# EAGLE design Simple-Temperature-Controller (EAGLE 6.3)

## Sheet 1 of 6: Switching Power Supply
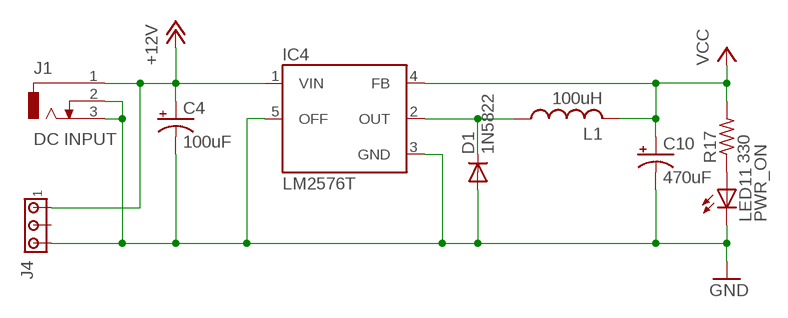
[diagram p0: schematic, sheet 1]

### Parts
C4  100uF  CPOL-USE2.5-6  [E2,5-6]
C10  470uF  CPOL-USE3.5-8  [E3,5-8]
D1  1N5822  1N5400  [DO201-15]
IC4  LM2576T  [TO220-5]
J1  DC INPUT  DCJ0202  [DCJ0202]
J4  MTA03-100  [10X03MTA]
L1  100uH  L-USTJ3-U2  [TJ3-U2]
LED11  PWR_ON  LED3MM  [LED3MM]
R17  330  R-US_0207/10  [0207/10]

### Nets
+12V [power]: C4.+ IC4.1(VIN) J1.1 J4.1 ; also sheet 6
GND [gnd]: C4.- C10.- D1.A IC4.3(GND) IC4.5(OFF) J1.2 J1.3 J4.3 LED11.K(C) ; also sheet 2,3,4,5,6
N$32: D1.C IC4.2(OUT) L1.1
N$33: LED11.A R17.1
VCC [vcc]: C10.+ IC4.4(FB) L1.2 R17.2 ; also sheet 2,4,5,6
Unconnected: J4.2

## Sheet 2 of 6: Minimum Sistem
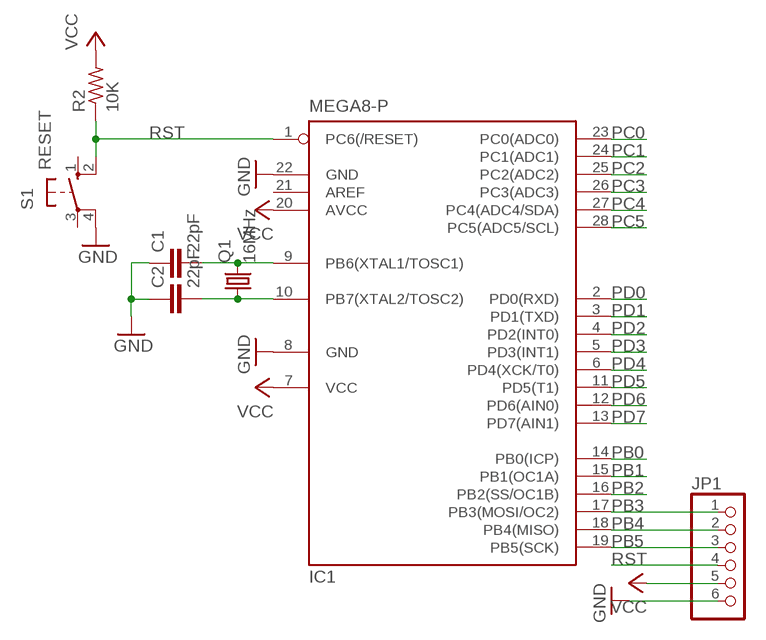
[diagram p1: schematic, sheet 2]

### Parts
C1  22pF  CAPACITOR025-024X044  [RESISTOR_C025-024X044]
C2  22pF  CAPACITOR025-024X044  [RESISTOR_C025-024X044]
IC1  MEGA8-P  [DIL28-3]
JP1  PINHD-1X6  [1X06]
Q1  16MHz  CRYSTALHC49S  [HC49/S]
R2  10K  RESISTOR0207/10  [RESISTOR_0207/10]
S1  RESET  PUSH-BUTTON  [B3F-10XX]

### Nets
GND [gnd]: C1.1 C2.1 IC1.8(GND) IC1.22(GND) JP1.6 S1.4(P1) ; also sheet 1,3,4,5,6
N$2: C1.2 IC1.9(PB6(XTAL1/TOSC1)) Q1.2
N$3: C2.2 IC1.10(PB7(XTAL2/TOSC2)) Q1.1
PB0: IC1.14(PB0(ICP)) ; also sheet 4
PB1: IC1.15(PB1(OC1A)) ; also sheet 4
PB2: IC1.16(PB2(SS/OC1B)) ; also sheet 4
PB3: IC1.17(PB3(MOSI/OC2)) JP1.1 ; also sheet 4
PB4: IC1.18(PB4(MISO)) JP1.2 ; also sheet 4
PB5: IC1.19(PB5(SCK)) JP1.3 ; also sheet 4
PC0: IC1.23(PC0(ADC0)) ; also sheet 3
PC1: IC1.24(PC1(ADC1)) ; also sheet 3
PC2: IC1.25(PC2(ADC2)) ; also sheet 3
PC3: IC1.26(PC3(ADC3)) ; also sheet 3
PC4: IC1.27(PC4(ADC4/SDA)) ; also sheet 5
PC5: IC1.28(PC5(ADC5/SCL)) ; also sheet 5
PD0: IC1.2(PD0(RXD)) ; also sheet 6
PD1: IC1.3(PD1(TXD)) ; also sheet 6
PD2: IC1.4(PD2(INT0)) ; also sheet 6
PD3: IC1.5(PD3(INT1)) ; also sheet 6
PD4: IC1.6(PD4(XCK/T0)) ; also sheet 6
PD5: IC1.11(PD5(T1))
PD6: IC1.12(PD6(AIN0))
PD7: IC1.13(PD7(AIN1))
RST: IC1.1(PC6(/RESET)) JP1.4 R2.1 S1.2(S1)
VCC [vcc]: IC1.7(VCC) IC1.20(AVCC) JP1.5 R2.2 ; also sheet 1,4,5,6
Unconnected: IC1.21(AREF) S1.1(S) S1.3(P)

## Sheet 3 of 6: Input Switch
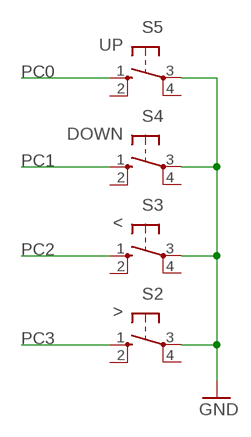
[diagram p2: schematic, sheet 3]

### Parts
S2  >  PUSH-BUTTON  [B3F-10XX]
S3  <  PUSH-BUTTON  [B3F-10XX]
S4  DOWN  PUSH-BUTTON  [B3F-10XX]
S5  UP  PUSH-BUTTON  [B3F-10XX]

### Nets
GND [gnd]: S2.3(P) S3.3(P) S4.3(P) S5.3(P) ; also sheet 1,2,4,5,6
PC0: S5.1(S) ; also sheet 2
PC1: S4.1(S) ; also sheet 2
PC2: S3.1(S) ; also sheet 2
PC3: S2.1(S) ; also sheet 2
Unconnected: S2.2(S1) S2.4(P1) S3.2(S1) S3.4(P1) S4.2(S1) S4.4(P1) S5.2(S1) S5.4(P1)

## Sheet 4 of 6: LCD 2X16
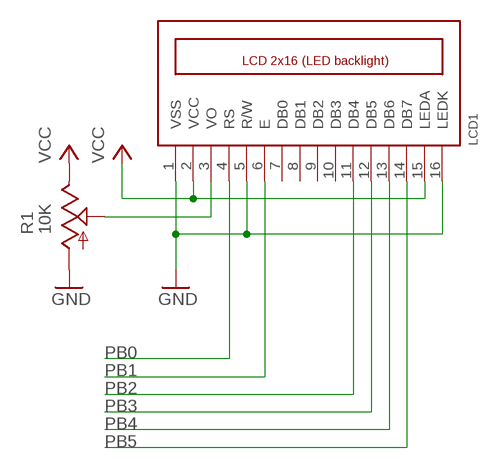
[diagram p3: schematic, sheet 4]

### Parts
LCD1  LCD-2X16  [LCD-2X16]
R1  10K  TRIMPOTCA6V  [POT_CA6V]

### Nets
GND [gnd]: LCD1.1(VSS) LCD1.5(R/W) LCD1.16(LEDK) R1.A ; also sheet 1,2,3,5,6
N$7: LCD1.3(VO) R1.S
PB0: LCD1.4(RS) ; also sheet 2
PB1: LCD1.6(E) ; also sheet 2
PB2: LCD1.11(DB4) ; also sheet 2
PB3: LCD1.12(DB5) ; also sheet 2
PB4: LCD1.13(DB6) ; also sheet 2
PB5: LCD1.14(DB7) ; also sheet 2
VCC [vcc]: LCD1.2(VCC) LCD1.15(LEDA) R1.E ; also sheet 1,2,5,6
Unconnected: LCD1.7(DB0) LCD1.8(DB1) LCD1.9(DB2) LCD1.10(DB3)

## Sheet 5 of 6: RTC
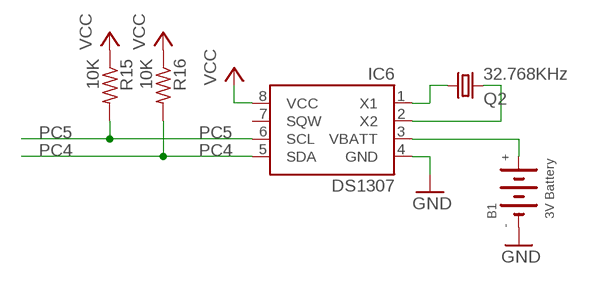
[diagram p4: schematic, sheet 5]

### Parts
B1  3V Battery  BATTERYCR2032  [CR2032]
IC6  DS1307  [DIP08]
Q2  32.768KHz  CRYSTALTC26H  [TC26H]
R15  10K  R-US_0207/10  [0207/10]
R16  10K  R-US_0207/10  [0207/10]

### Nets
GND [gnd]: B1.- IC6.4(GND) ; also sheet 1,2,3,4,6
N$29: IC6.1(X1) Q2.1
N$30: IC6.2(X2) Q2.2
N$31: B1.+ IC6.3(VBATT)
PC4: IC6.5(SDA) R16.2 ; also sheet 2
PC5: IC6.6(SCL) R15.2 ; also sheet 2
VCC [vcc]: IC6.8(VCC) R15.1 R16.1 ; also sheet 1,2,4,6
Unconnected: IC6.7(SQW)

## Sheet 6 of 6: Sensor & Relay Output
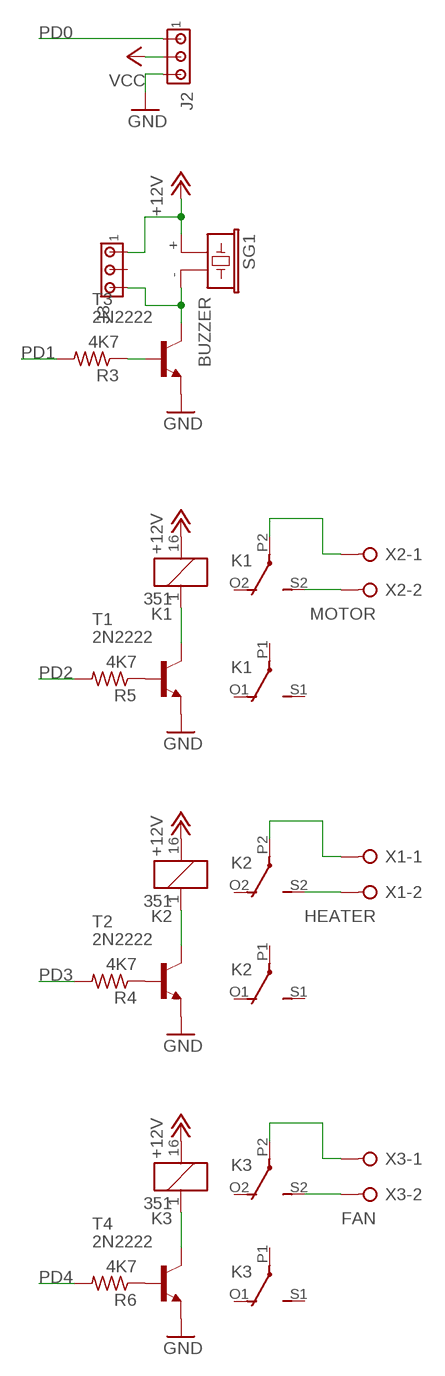
[diagram p5: schematic, sheet 6]

### Parts
J2  MTA03-100  [10X03MTA]
J3  MTA03-100  [10X03MTA]
K1  351  [351]
K2  351  [351]
K3  351  [351]
R3  4K7  R-US_0207/10  [0207/10]
R4  4K7  R-US_0207/10  [0207/10]
R5  4K7  R-US_0207/10  [0207/10]
R6  4K7  R-US_0207/10  [0207/10]
SG1  BUZZER  F/CM12P  [F/CM12P]
T1  2N2222  [TO92-EBC-OVAL]
T2  2N2222  [TO92-EBC-OVAL]
T3  2N2222  [TO92-EBC-OVAL]
T4  2N2222  [TO92-EBC-OVAL]
X1  HEATER  W237-02P  [W237-132]
X2  MOTOR  W237-02P  [W237-132]
X3  FAN  W237-02P  [W237-132]

### Nets
+12V [power]: J3.1 K1.16 K2.16 K3.16 SG1.+ ; also sheet 1
GND [gnd]: J2.3 T1.E T2.E T3.E T4.E ; also sheet 1,2,3,4,5
N$1: R5.1 T1.B
N$4: K1.1 T1.C
N$5: K2.1 T2.C
N$6: K1.P2(3:P) X2.1
N$8: K2.S2(3:S) X1.2
N$9: R4.1 T2.B
N$10: K3.1 T4.C
N$11: K3.S2(3:S) X3.2
N$12: R6.1 T4.B
N$13: K1.S2(3:S) X2.2
N$14: K2.P2(3:P) X1.1
N$15: K3.P2(3:P) X3.1
N$18: J3.3 SG1.- T3.C
N$19: R3.1 T3.B
PD0: J2.1 ; also sheet 2
PD1: R3.2 ; also sheet 2
PD2: R5.2 ; also sheet 2
PD3: R4.2 ; also sheet 2
PD4: R6.2 ; also sheet 2
VCC [vcc]: J2.2 ; also sheet 1,2,4,5
Unconnected: J3.2 K1.O1(2:O) K1.O2(3:O) K1.P1(2:P) K1.S1(2:S) K2.O1(2:O) K2.O2(3:O) K2.P1(2:P) K2.S1(2:S) K3.O1(2:O) K3.O2(3:O) K3.P1(2:P) K3.S1(2:S)

## Library data of the parts
B1 = microbuilder:BATTERY
C1 C2 = barelang-store:CAPACITOR: CAPACITOR, European symbol
C4 C10 = resistor:CPOL-US: POLARIZED CAPACITOR, American symbol
D1 = diode:1N5400: DIODE standard rectifier, 3 A, 50 V (Motorola)
IC1 = atmel:MEGA8-P: MICROCONTROLLER 8 Kbytes FLASH, 1 kbytes SRAM, 512 bytes EEPROM, USART, 4-channel 10 bit ADC, 2-channel 8 bit ADC Pin compatible with Atmega48, ATMega88, ATMega168 Source: avr.lbr; OC_FARNELL: unknown; OC_NEWARK: unknown
IC4 = v-reg-3:LM2576: National Semiconductor <http://www.national.com> 3.0A "Simple Switcher"(c) 52kHz, Vout 1.23-37V (HV: 57V), Vin 40V (HV: 60V), 50µA standby current
IC6 = SparkFun:DS1307
J1 = con-jack:DCJ0202: DC POWER JACK Source: DCJ0202.pdf; OC_FARNELL: unknown; OC_NEWARK: unknown
J2-J4 = con-amp:MTA03-100: AMP connector
JP1 = barelang-store:PINHD-1X6: PIN HEADER
K1-K3 = relay:351: RELAY 2 x switch, Omron; OC_FARNELL: unknown; OC_NEWARK: unknown
L1 = resistor:L-US: INDUCTOR, American symbol
LCD1 = barelang-store:LCD-2X16
LED11 = led:LED: LED OSRAM: - CHIPLED LG R971, LG N971, LY N971, LG Q971, LY Q971, LO R971, LY R971 LH N974, LH R974 LS Q976, LO Q976, LY Q976 LO Q996 - Hyper CHIPLED LW Q18S LB Q993, LB Q99A, LB R99A - SideLED LS A670, LO A670, LY A670, LG A670, LP A670 LB A673, LV A673, LT A673, LW A673 LH A674 LY A675 LS A676, LA A676, LO A676, LY A676, LW A676 LS A679, LY A679, LG A679 - Hyper Micro SIDELED® LS Y876, LA Y876, LO Y876, LY Y876 LT Y87S - SmartLED LW L88C, LW L88S LB L89C, LB L89S, LG L890 LS L89K, LO L89K, LY L89K LS L896, LA L896, LO L896, LY L896 - TOPLED LS T670, LO T670, LY T670, LG T670, LP T670 LSG T670, LSP T670, LSY T670, LOP T670, LYG T670 LG T671, LOG T671, LSG T671 LB T673, LV T673, LT T673, LW T673 LH T674 LS T676, LA T676, LO T676, LY T676, LB T676, LH T676, LSB T676, LW T676 LB T67C, LV T67C, LT T67C, LS T67K, LO T67K, LY T67K, LW E67C LS E67B, LA E67B, LO E67B, LY E67B, LB E67C, LV E67C, LT E67C LW T67C LS T679, LY T679, LG T679 LS T770, LO T770, LY T770, LG T770, LP T770 LB T773, LV T773, LT T773, LW T773 LH T774 LS E675, LA E675, LY E675, LS T675 LS T776, LA T776, LO T776, LY T776, LB T776 LHGB T686 LT T68C, LB T68C - Hyper Mini TOPLED® LB M676 - Mini TOPLED Santana® LG M470 LS M47K, LO M47K, LY M47K Source: http://www.osram.convergy.de LUXEON: - LUMILED® LXK2-PW12-R00, LXK2-PW12-S00, LXK2-PW14-U00, LXK2-PW14-V00 LXK2-PM12-R00, LXK2-PM12-S00, LXK2-PM14-U00 LXK2-PE12-Q00, LXK2-PE12-R00, LXK2-PE12-S00, LXK2-PE14-T00, LXK2-PE14-U00 LXK2-PB12-K00, LXK2-PB12-L00, LXK2-PB12-M00, LXK2-PB14-N00, LXK2-PB14-P00, LXK2-PB14-Q00 LXK2-PR12-L00, LXK2-PR12-M00, LXK2-PR14-Q00, LXK2-PR14-R00 LXK2-PD12-Q00, LXK2-PD12-R00, LXK2-PD12-S00 LXK2-PH12-R00, LXK2-PH12-S00 LXK2-PL12-P00, LXK2-PL12-Q00, LXK2-PL12-R00 Source: www.luxeon.com KINGBRIGHT: KA-3528ASYC Source: www.kingbright.com
Q1 = barelang-store:CRYSTAL: CRYSTAL; OC_FARNELL: 1667008; OC_NEWARK: unknown
Q2 = crystal:CRYSTAL: CRYSTAL; OC_FARNELL: unknown; OC_NEWARK: unknown
R1 = barelang-store:TRIMPOT: POTENTIOMETER
R2 = barelang-store:RESISTOR: RESISTOR, American symbol
R3-R6 R15-R17 = resistor:R-US_: RESISTOR, American symbol
S1-S5 = barelang-store:PUSH-BUTTON: OMRON SWITCH; MPN: B3F-1000; OC_FARNELL: 176432; OC_NEWARK: 36M3542
SG1 = buzzer:F/CM12P: BUZZER Source: Buerklin; OC_FARNELL: unknown; OC_NEWARK: unknown
T1-T4 = adafruit:2N2222: NPN TRANSISTOR Big oval pads
X1-X3 = con-wago-508:W237-02P: WAGO SREW CLAMP; OC_FARNELL: unknown; OC_NEWARK: unknown

## Net classes
0 default: width 0.4 mm
1 power: width 0.7 mm
2 gnd: width 0.5 mm
3 vcc: width 0.5 mm

## Board
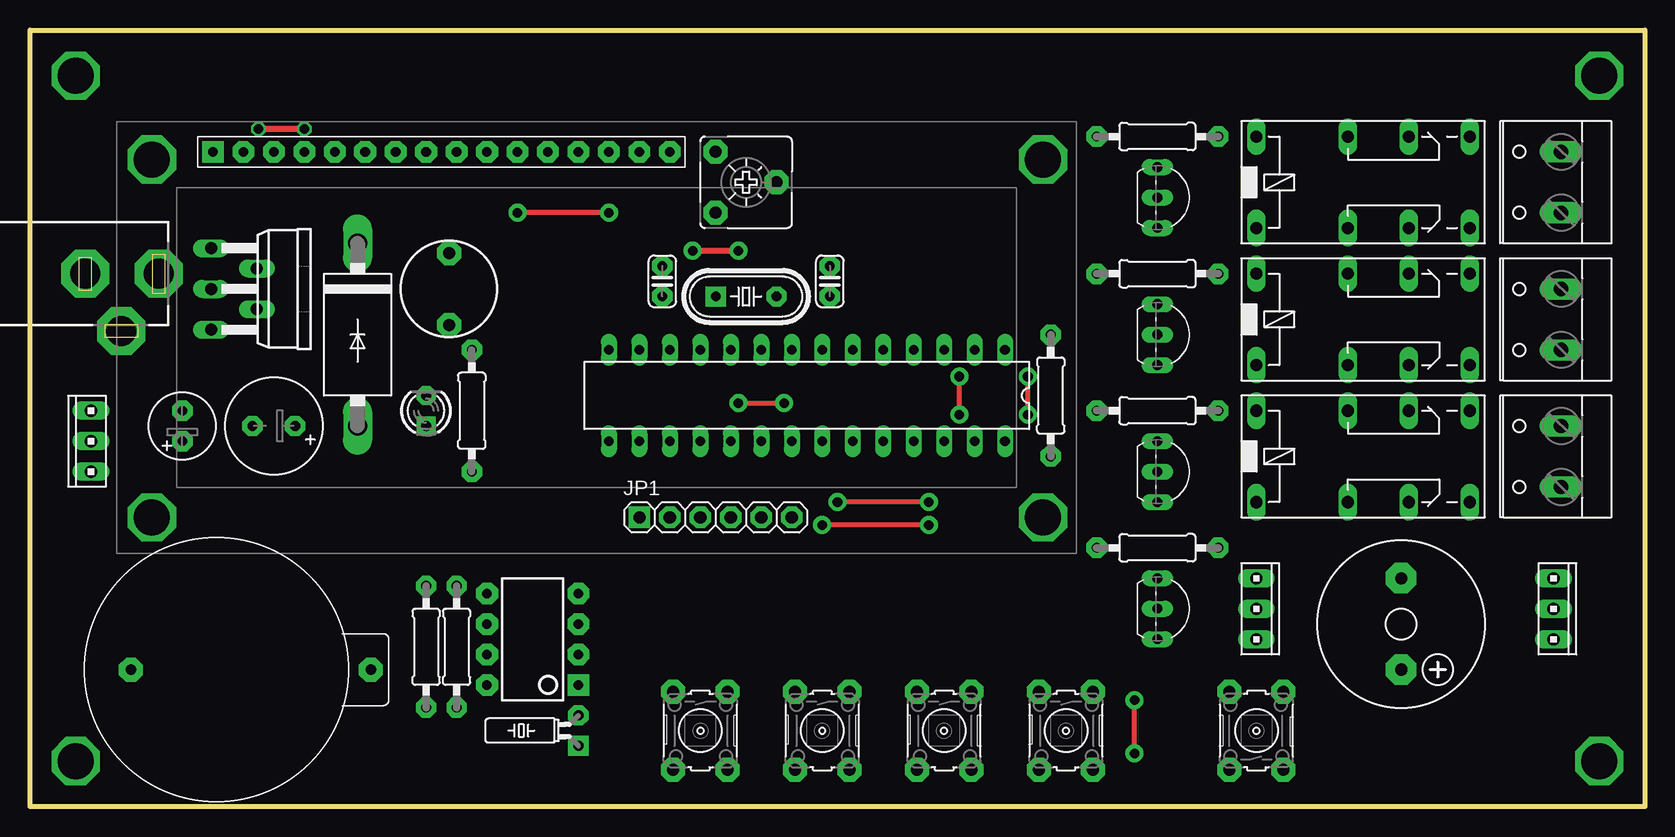
[diagram p6: board, top side]
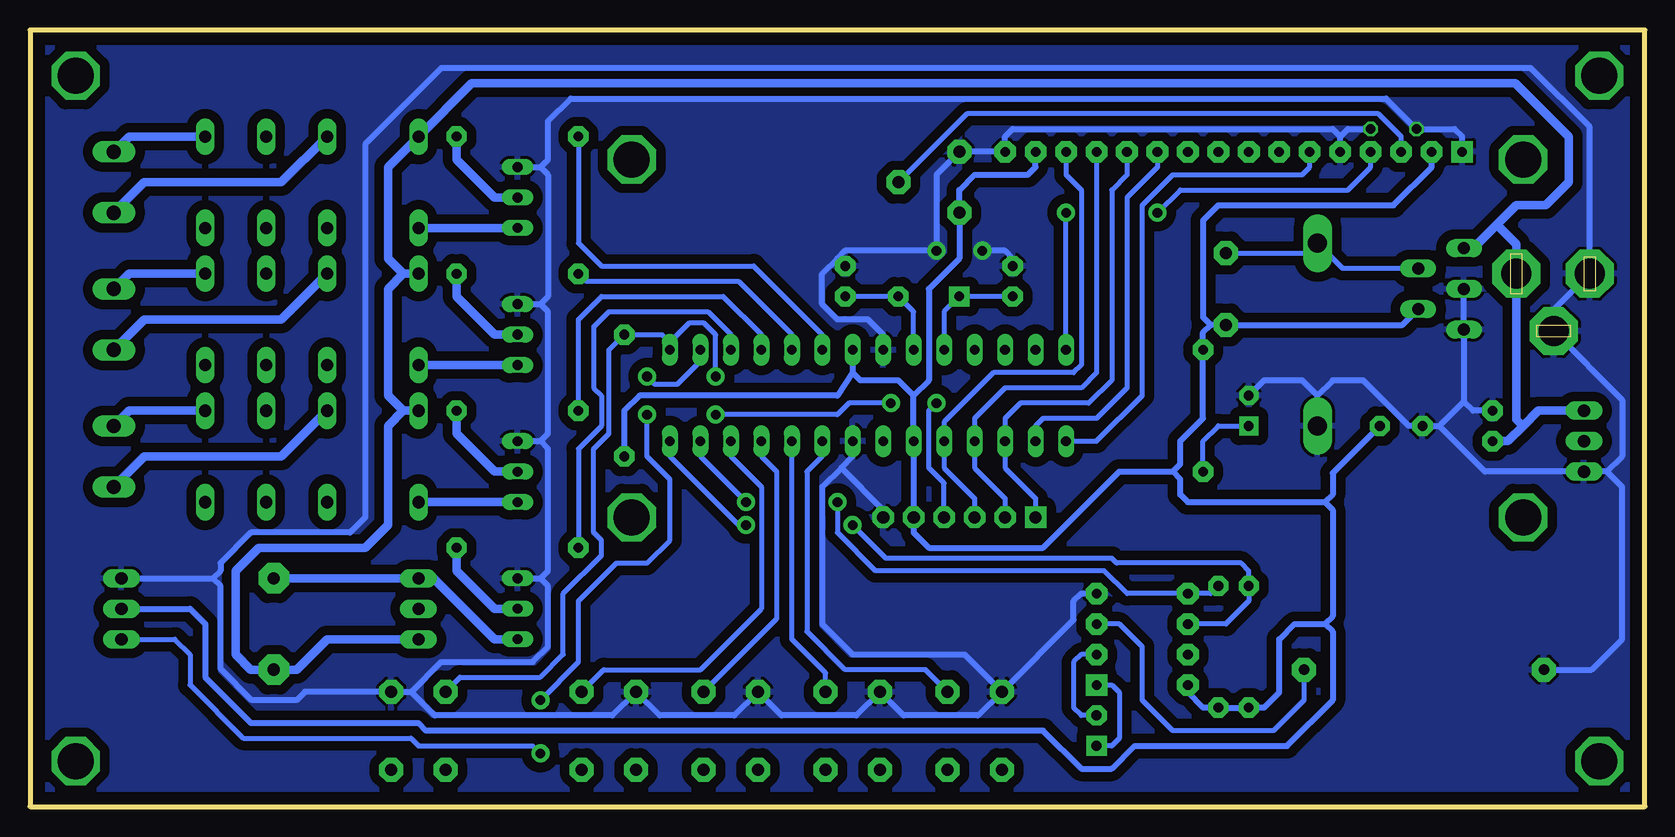
[diagram p7: board, bottom side, seen from below]

Size 134.62 x 64.77 mm. Coordinates in mm from the lower left corner, seen from the top.
Outline: 0,64.77 134.62,64.77 134.62,0 0,0 0,64.77
Copper layers (1*16): Top 0.035mm / dielectric 1.5mm / Bottom 0.035mm
Design rules "default": minimum track width 10mil, minimum drill 24mil, track to track 8mil, track to pad 8mil, pad to pad 8mil, via to via 8mil, smd to smd 8mil, copper to edge 40mil, drill to drill 8mil, minimum pad ring 10mil, minimum via ring 8mil, stop-mask expansion 4mil, vias tented up to drill 0mil, thermal gap 10mil

### Footprints (pad centres in the part's own frame; a part is rotated, then mirrored left to right if it is on the bottom)
CR2032 = drill 0.9 pad 2 octagon: + 10,0; - -10,0
RESISTOR_C025-024X044 = drill 0.8 pad 1.7 octagon: 1 -1.27,0; 2 1.27,0
E2,5-6 = drill 0.8 pad 1.7 octagon: + -1.27,0; - 1.27,0
E3,5-8 = drill 0.813 pad 1.7 octagon: + -1.778,0; - 1.778,0
DO201-15 = drill 1.6 long: A 7.62,0; C -7.62,0
DIL28-3 = drill 0.813 long: 1 -16.51,-3.81; 2 -13.97,-3.81; 3 -11.43,-3.81; 4 -8.89,-3.81; 5 -6.35,-3.81; 6 -3.81,-3.81; 7 -1.27,-3.81; 8 1.27,-3.81; 9 3.81,-3.81; 10 6.35,-3.81; 11 8.89,-3.81; 12 11.43,-3.81; 13 13.97,-3.81; 14 16.51,-3.81; 15 16.51,3.81; 16 13.97,3.81; 17 11.43,3.81; 18 8.89,3.81; 19 6.35,3.81; 20 3.81,3.81; 21 1.27,3.81; 22 -1.27,3.81; 23 -3.81,3.81; 24 -6.35,3.81; 25 -8.89,3.81; 26 -11.43,3.81; 27 -13.97,3.81; 28 -16.51,3.81
TO220-5 = drill 1 long: 1 -3.4,-8.4; 2 -1.7,-4.59; 3 0,-8.4; 4 1.7,-4.59; 5 3.4,-8.4
DIP08 = drill 0.8 pad 1.8 square: 1 -3.81,-3.81 | drill 0.8 pad 1.8 octagon: 2 -1.27,-3.81; 3 1.27,-3.81; 4 3.81,-3.81; 5 3.81,3.81; 6 1.27,3.81; 7 -1.27,3.81; 8 -3.81,3.81
DCJ0202 = drill 2.5 pad 4 octagon: 1 0,3.1; 2 4.8,0; 3 0,-3
10X03MTA = drill 1.016 long: 1 2.54,0; 2 0,0; 3 -2.54,0
1X06 = drill 1.016 pad 1.8 square: 1 -6.35,0 | drill 1.016 pad 1.8 octagon: 2 -3.81,0; 3 -1.27,0; 4 1.27,0; 5 3.81,0; 6 6.35,0
351 = drill 1.016 long: 1 -3.81,-3.81; 16 -3.81,3.81; O1 8.89,-3.81; O2 8.89,3.81; P1 3.81,-3.81; P2 3.81,3.81; S1 13.97,-3.81; S2 13.97,3.81
TJ3-U2 = drill 1 pad 2 octagon: 1 -3,0; 2 3,0
LCD-2X16 = drill 0.8 pad 1.8 square: 1 2.54,0 | drill 0.8 pad 1.8 octagon: 2 5.08,0; 3 7.62,0; 4 10.16,0; 5 12.7,0; 6 15.24,0; 7 17.78,0; 8 20.32,0; 9 22.86,0; 10 25.4,0; 11 27.94,0; 12 30.48,0; 13 33.02,0; 14 35.56,0; 15 38.1,0; 16 40.64,0
LED3MM = drill 0.8 pad 1.6 square: A -1.27,0 | drill 0.8 pad 1.6 octagon: K 1.27,0
HC49/S = drill 0.8 pad 1.7 square: 1 -2.54,0 | drill 0.8 pad 1.7 octagon: 2 2.54,0
TC26H = drill 0.813 pad 1.7 square: 1 -1.27,0 | drill 0.813 pad 1.7 octagon: 2 1.27,0
POT_CA6V = drill 1 pad 2 octagon: A -2.54,-2.54; E 2.54,-2.54; S 0,2.54
RESISTOR_0207/10 = drill 0.8 pad 1.7 octagon: 1 -5.08,0; 2 5.08,0
0207/10 = drill 0.8 pad 1.7 octagon: 1 -5.08,0; 2 5.08,0
B3F-10XX = drill 1 pad 2 octagon: 1 -3.251,2.261; 2 3.251,2.261; 3 -3.251,-2.261; 4 3.251,-2.261
F/CM12P = drill 1.016 pad 2.54 octagon: + 3.81,0; - -3.81,0
TO92-EBC-OVAL = drill 0.813 long: B 0,-1.27; C 2.54,-1.27; E -2.54,-1.27
W237-132 = drill 1.194 long: 1 -2.54,-0.635; 2 2.54,-0.635

### Placement (x,y rotation side)
B1  18.41,11.43 0 top
C1  66.67,43.81 270 top
C2  52.7,43.81 270 top
C4  12.7,31.75 90 top
C10  20.32,31.75 180 top
D1  27.3,39.37 270 top
IC1  64.77,34.29 180 top
IC4  23.5,43.18 270 top
IC6  41.91,13.97 90 top
J1  7.62,44.45 270 top
J2  127,16.51 270 top
J3  102.23,16.51 270 top
J4  5.08,30.48 90 top
JP1  57.15,24.13 0 top
K1  106.05,29.21 0 top
K2  106.05,40.64 0 top
K3  106.05,52.07 0 top
L1  34.92,43.18 270 top
LCD1  12.7,54.61 0 top
LED11  33.02,33.02 90 top
Q1  59.69,42.55 0 top
Q2  45.72,6.35 90 top
R1  59.69,52.07 270 top
R2  85.09,34.29 270 top
R3  93.98,21.59 180 top
R4  93.98,44.45 180 top
R5  93.98,33.02 180 top
R6  93.98,55.88 180 top
R15  33.02,13.34 90 top
R16  35.56,13.34 90 top
R17  36.83,33.02 90 top
S1  102.23,6.35 90 top
S2  86.36,6.35 270 top
S3  76.2,6.35 270 top
S4  66.04,6.35 270 top
S5  55.88,6.35 270 top
SG1  114.3,15.24 270 top
T1  95.25,27.94 270 top
T2  95.25,39.37 270 top
T3  95.25,16.51 270 top
T4  95.25,50.8 270 top
X1  127,40.64 90 top
X2  127,29.21 90 top
X3  127,52.07 90 top

### Tracks (layer width: path | path; a pad name or v marks a point on that pad's centre or on a via)
+12V
  Bottom 0.7: 103.5,33.02 K1.16 | J1.1 10.76,44.49 | J3.1 109.85,13.97 112.39,11.43 SG1.+ 116.2,11.43 117.47,12.7 117.47,19.69 115.57,21.59 106.68,21.59 104.78,23.49 104.78,31.75 103.5,33.02 | IC4.1 14.3,46.58 12.34,48.54 | 12.34,48.54 10.72,50.17 8.25,50.17 6.35,52.07 6.35,55.88 10.8,60.33 97.79,60.33 K3.16 104.78,53.34 104.78,45.72 103.5,44.45 | J1.1 10.72,46.92 12.34,48.54 | J4.1 8.89,33.02 10.16,31.75 | 10.16,31.75 11.43,30.48 C4.+ | J1.1 10.72,32.31 10.16,31.75 | 103.5,44.45 K2.16 | 103.5,33.02 104.78,34.29 104.78,43.18 103.5,44.45
GND  (via drill 0.8, 0.8 pad 1.5)
  Top 0.5: v55.25,46.36 v59.05,46.36 | v22.86,56.52 v19.05,56.52
  Bottom 0.5: LED11.K 31.75,35.56 28.58,35.56 27.3,34.29 | S5.3 47.62,15.6 47.62,17.15 46.99,17.78 IC6.4 | S5.3 55.6,7.62 61.8,7.62 S4.3 65.76,7.62 71.96,7.62 S3.3 75.92,7.62 82.12,7.62 S2.3 86.08,7.62 100.89,7.62 102.87,9.6 | IC4.3 IC4.5 15.09,33.8 | S5.3 56.72,12.7 66.04,12.7 68.58,15.24 68.58,26.67 66.99,28.26 | IC1.22 66.04,29.21 66.99,28.26 | IC1.8 63.5,39.37 64.77,40.64 67.31,40.64 68.58,41.91 68.58,44.45 67.31,45.72 | 92.08,53.34 91.44,52.7 91.44,42.55 92.08,41.91 | T2.E 92.08,41.91 | T1.E 92.08,30.48 | 92.08,30.48 91.44,31.12 91.44,41.28 92.08,41.91 | T3.E 92.08,19.05 | 92.08,19.05 91.44,19.69 91.44,29.84 92.08,30.48 | 92.08,19.05 91.44,18.41 91.44,13.34 92.71,12.06 100.33,12.06 102.79,9.6 102.87,9.6 | 92.08,53.34 91.44,53.97 91.44,57.15 89.53,59.06 21.59,59.06 v19.05,56.52 15.88,56.52 15.24,55.88 LCD1.1 | T4.E 92.08,53.34 | 102.87,9.6 S1.4 111.68,9.6 112.39,8.89 116.13,8.89 118.75,11.51 118.75,18.41 119.38,19.05 | LCD1.5 25.4,55.88 | 25.4,55.88 26.03,56.52 52.7,56.52 53.34,55.88 LCD1.16 R1.A 59.05,52.7 v59.05,46.36 66.67,46.36 67.31,45.72 | 17.14,31.75 C10.- 19.69,31.75 23.5,35.56 26.03,35.56 27.3,34.29 | 17.14,31.75 15.09,33.8 | 17.14,31.75 13.33,27.94 J4.3 3.17,27.94 | C4.- 14.31,33.02 15.09,33.8 | C2.1 52.7,45.72 53.34,46.36 v55.25,46.36 | C1.1 67.31,45.72 | 25.4,55.88 24.77,56.52 v22.86,56.52 | J2.3 119.38,19.05 | 119.38,19.05 118.75,19.69 118.75,20.32 116.2,22.86 107.95,22.86 106.68,24.13 106.68,55.25 100.33,61.59 9.52,61.59 4.62,56.69 J1.3 7.62,41.45 J1.2 1.91,33.94 1.91,29.21 3.17,27.94 | D1.A 27.3,34.29 | B1.- 4.44,11.43 1.91,13.97 1.91,26.67 3.17,27.94 | JP1.6 63.5,24.77 66.99,28.26
  pour Bottom (isolate 0.8): 0,64.77 134.62,64.77 134.62,0 0,0
N$1
  Bottom 0.7: T1.B 95.88,27.94 99.06,31.12 R5.1
N$2
  Bottom 0.4: IC1.9 60.96,41.28 Q1.2 C1.2
N$3
  Bottom 0.4: IC1.10 58.42,41.28 Q1.1 C2.2
N$4
  Bottom 0.7: K1.1 T1.C
N$5
  Bottom 0.7: K2.1 T2.C
N$6
  Bottom 0.7: K1.P2 113.66,29.21 125.09,29.21 X2.1
N$7
  Bottom 0.4: R1.S 56.52,57.78 22.22,57.78 20.32,55.88 LCD1.3
N$8
  Bottom 0.7: K2.S2 126.36,44.45 X1.2
N$9
  Bottom 0.7: R4.1 99.06,42.55 95.88,39.37 T2.B
N$10
  Bottom 0.7: K3.1 T4.C
N$11
  Bottom 0.7: K3.S2 126.36,55.88 X3.2
N$12
  Bottom 0.7: R6.1 99.06,53.97 95.88,50.8 T4.B
N$13
  Bottom 0.7: K1.S2 126.36,33.02 X2.2
N$14
  Bottom 0.7: K2.P2 113.66,40.64 125.09,40.64 X1.1
N$15
  Bottom 0.7: K3.P2 113.66,52.07 125.09,52.07 X3.1
N$16  (via drill 3)
  other vias: 3.81,60.96
N$17  (via drill 3)
  other vias: 3.81,3.81
N$18
  Bottom 0.7: SG1.- J3.3 100.97,19.05 95.88,13.97 T3.C
N$19
  Bottom 0.7: T3.B 95.88,16.51 99.06,19.69 R3.1
N$20  (via drill 3)
  other vias: 130.81,3.81
N$21  (via drill 3)
  other vias: 130.81,60.96
N$22
  pour Bottom (isolate 0.8): 0,64.77 134.62,64.77 134.62,0 0,0
N$23  (via drill 3)
  other vias: 10.16,53.97
N$24  (via drill 3)
  other vias: 84.45,53.97
N$25  (via drill 3)
  other vias: 84.45,24.13
N$26  (via drill 3)
  other vias: 10.16,24.13
N$29
  Bottom 0.4: IC6.1 44.45,10.16 43.81,9.52 43.81,5.71 44.45,5.08 Q2.1
N$30
  Bottom 0.4: IC6.2 46.99,12.7 47.62,12.06 47.62,8.25 46.99,7.62 Q2.2
N$31
  Bottom 0.4: B1.+ 28.41,8.89 30.95,6.35 39.37,6.35 41.91,8.89 41.91,13.34 43.81,15.24 IC6.3
N$32
  Bottom 0.4: IC4.2 25.19,44.88 D1.C 28.11,46.18 L1.1
N$33
  Bottom 0.4: R17.1 36.83,30.48 35.56,31.75 LED11.A
PB0  (via drill 0.8 pad 1.5)
  Top 0.4: v48.26,49.53 v40.64,49.53
  Bottom 0.4: IC1.14 v48.26,49.53 | v40.64,49.53 38.73,51.44 24.77,51.44 22.86,53.34 LCD1.4
PB1
  Bottom 0.4: IC1.15 45.72,30.48 41.91,34.29 41.91,50.17 39.37,52.7 28.58,52.7 27.94,53.34 LCD1.6
PB2
  Bottom 0.4: IC1.16 50.8,31.75 50.16,32.38 45.72,32.38 43.18,34.92 43.18,50.8 40.64,53.34 LCD1.11
PB3
  Bottom 0.4: LCD1.12 43.18,52.7 44.45,51.44 44.45,35.56 46.36,33.66 52.07,33.66 53.34,32.38 IC1.17 53.34,28.26 50.8,25.72 JP1.1
PB4
  Bottom 0.4: LCD1.13 45.72,36.2 46.99,34.92 53.34,34.92 55.88,32.38 IC1.18 55.88,28.26 53.34,25.72 JP1.2
PB5
  Bottom 0.4: LCD1.14 48.26,52.7 46.99,51.44 46.99,36.83 47.62,36.2 54.29,36.2 58.42,32.07 IC1.19 58.42,28.26 55.88,25.72 JP1.3
PC0
  Bottom 0.4: S5.1 59.97,11.43 66.67,11.43 69.85,14.61 69.85,27.94 68.58,29.21 IC1.23
PC1
  Bottom 0.4: IC1.24 71.12,13.97 68.3,11.15 S4.1
PC2
  Bottom 0.4: S3.1 72.39,15.67 72.39,27.94 73.66,29.21 IC1.25
PC3
  Bottom 0.4: S2.1 86.79,11.43 78.74,11.43 73.66,16.51 73.66,26.67 76.2,29.21 IC1.26
PC4  (via drill 0.8 pad 1.5)
  Top 0.4: v74.93,25.4 v67.31,25.4
  Bottom 0.4: R16.2 36.19,17.78 IC6.5 43.18,17.78 45.08,19.69 64.13,19.69 67.31,22.86 v67.31,25.4 | IC1.27 78.74,29.21 v74.93,25.4
PC5  (via drill 0.8 pad 1.5)
  Top 0.4: v74.93,23.49 v66.04,23.49
  Bottom 0.4: IC6.6 34.92,15.24 33.02,17.15 R15.2 33.02,19.69 33.66,20.32 44.05,20.32 44.45,20.72 63.27,20.72 v66.04,23.49 | IC1.28 81.28,29.21 75.56,23.49 v74.93,23.49
PD0  (via drill 0.8 pad 1.5)
  Top 0.4: v92.08,4.45 v92.08,8.89 | v83.19,32.7 v83.19,35.88
  Bottom 0.4: J2.1 122.55,13.97 121.28,12.7 121.28,10.16 116.84,5.71 102.87,5.71 102.23,5.08 92.71,5.08 v92.08,4.45 | v92.08,8.89 88.9,12.06 88.9,17.15 85.72,20.32 83.19,20.32 81.28,22.23 81.28,27.3 83.19,29.21 v83.19,32.7 | IC1.2 78.74,37.15 80.64,35.24 82.55,35.24 v83.19,35.88
PD1
  Bottom 0.4: IC1.3 76.2,39.37 78.1,41.28 86.36,41.28 87.63,40.01 87.63,34.92 87,34.29 87,31.75 88.9,29.84 R3.2
PD2
  Bottom 0.4: R5.2 88.9,40.64 87,42.55 76.84,42.55 73.66,39.37 IC1.4
PD3
  Bottom 0.4: R4.2 88.27,43.81 75.56,43.81 71.12,39.37 IC1.5
PD4
  Bottom 0.4: R6.2 88.9,46.99 87,45.08 74.29,45.08 68.58,39.37 IC1.6
RST  (via drill 0.8 pad 1.5)
  Top 0.4: v59.05,33.66 v62.86,33.66 | v77.47,32.7 v77.47,35.88
  Bottom 0.4: S1.2 98.78,10.8 92.08,10.8 90.17,12.7 90.17,17.78 87,20.95 87,22.23 87.63,22.86 87.63,29.84 86.36,31.12 86.36,38.1 R2.1 81.91,39.37 81.28,38.73 | 81.28,38.73 IC1.1 | JP1.4 58.42,26.99 59.69,28.26 59.69,33.02 v59.05,33.66 | v77.47,35.88 77.47,39.37 78.42,40.32 79.69,40.32 81.28,38.73 | v62.86,33.66 66.36,33.66 67.31,32.7 v77.47,32.7
VCC
  Bottom 0.5: R2.2 85.09,33.02 83.82,34.29 67.31,34.29 66.04,36.2 | 60.96,34.29 62.23,35.56 65.41,35.56 66.04,36.2 | 60.96,34.29 59.69,35.56 59.69,43.18 57.15,45.72 R1.E 57.15,51.44 55.88,52.7 51.44,52.7 50.8,53.34 LCD1.15 | C10.+ 26.03,27.81 26.03,26.04 26.67,25.4 | 60.96,34.29 IC1.20 JP1.5 60.96,22.86 59.69,21.59 50.16,21.59 43.81,27.94 39.37,27.94 | IC6.8 38.1,9.52 36.83,8.25 R16.1 R15.1 31.75,8.25 30.48,9.52 30.48,13.97 29.21,15.24 26.67,15.24 | LCD1.2 17.78,53.34 20.95,50.17 35.56,50.17 36.83,48.89 36.83,40.81 36.19,40.18 | J2.2 121.28,16.51 120.02,15.24 120.02,10.8 116.2,6.98 102.23,6.98 101.6,6.35 50.16,6.35 46.99,3.18 44.45,3.18 42.55,5.08 29.84,5.08 26.03,8.89 26.03,14.61 26.67,15.24 | 26.67,25.4 38.1,25.4 38.73,26.04 38.73,27.3 39.37,27.94 | 26.67,25.4 26.03,24.77 26.03,15.88 26.67,15.24 | 36.19,40.18 L1.2 20.2,40.18 IC4.4 | 36.19,40.18 36.83,39.55 R17.2 36.83,32.38 38.73,30.48 38.73,28.58 39.37,27.94 | IC1.7 66.04,36.2